# Altium schematic sheet X7A15T-Prog.SchDoc: X7A15T-Prog
size A4; Organization: Semi-ATE; SheetNumber: 7; SheetTotal: 7; Date: JUN 2020; ApprovedBy: Hören; CheckedBy: Mörz; Author: Hören; DrawnBy: Rudziński; Engineer: Hören
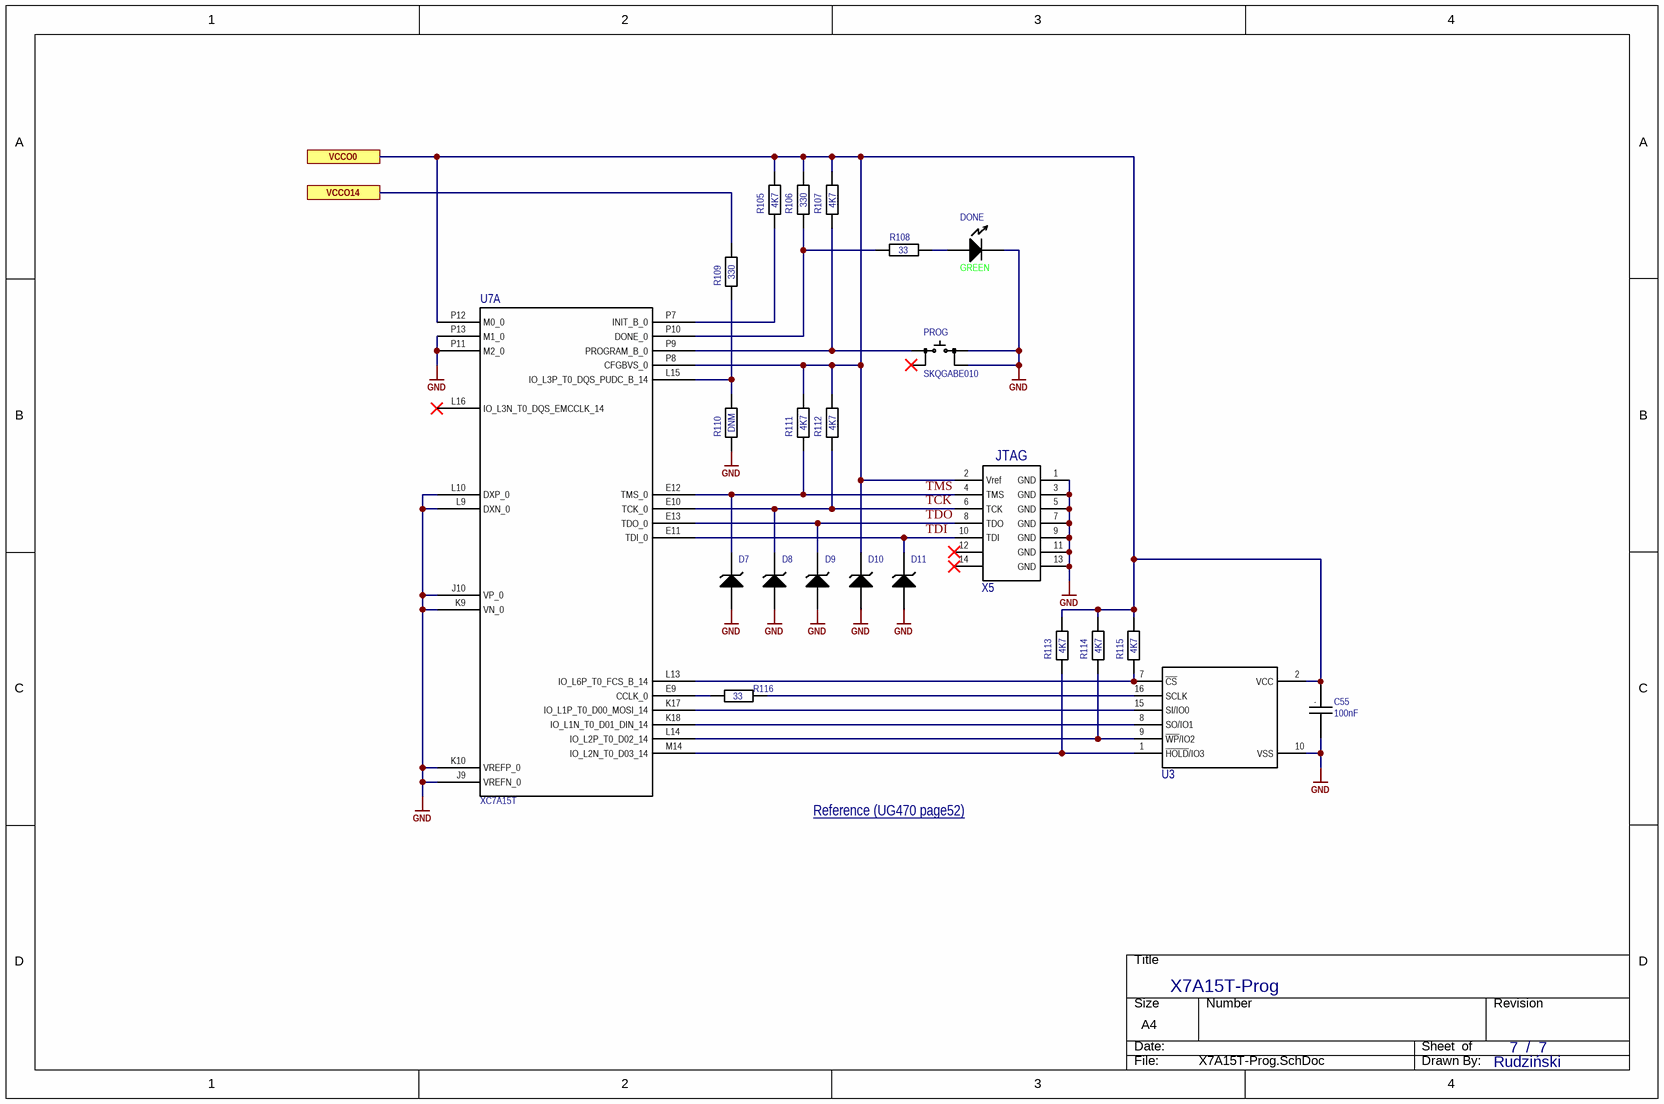
[diagram p0: X7A15T-Prog.SchDoc]

## Parts
C55  value 100nF  [C0402 Reflow]  (hidden comment: C)
D7  D  [SOD323]  (value not drawn)
D8  D  [SOD323]  (value not drawn)
D9  D  [SOD323]  (value not drawn)
D10  D  [SOD323]  (value not drawn)
D11  D  [SOD323]  (value not drawn)
DONE  Color: GREEN  [L0603G]  (hidden comment: D)
PROG  SKQGABE010  [SKQGABE010]
R105  value 4K7  [R0402 Reflow]  (hidden comment: R)
R106  value 330  [R0402 Reflow]  (hidden comment: R)
R107  value 4K7  [R0402 Reflow]  (hidden comment: R)
R108  value 33  [R0402 Reflow]  (hidden comment: R)
R109  value 330  [R0402 Reflow]  (hidden comment: R)
R110  value DNM  [R0402 Reflow]  (hidden comment: R)  (no BOM)
R111  value 4K7  [R0402 Reflow]  (hidden comment: R)
R112  value 4K7  [R0402 Reflow]  (hidden comment: R)
R113  value 4K7  [R0402 Reflow]  (hidden comment: R)
R114  value 4K7  [R0402 Reflow]  (hidden comment: R)
R115  value 4K7  [R0402 Reflow]  (hidden comment: R)
R116  value 33  [R0402 Reflow]  (hidden comment: R)
U3  U  [SOICW-16]  (value not drawn)
U7  NicName: XC7A15T  [XC7A15T-1CSG324C]  (hidden comment: U)  (part A of 8)
X5  NickName: JTAG  [LTMM-107-02-F-D]  (hidden comment: X)

## Ports
VCCO0, VCCO14

## Nets
GND: C55.2 D7.1(A) D8.1(A) D9.1(A) D10.1(A) D11.1(A) DONE.2(Cathode) PROG.3 PROG.4 R110.1 U3.10(VSS) U7.J9(VREFN_0) U7.J10(VP_0) U7.K9(VN_0) U7.K10(VREFP_0) U7.L9(DXN_0) U7.L10(DXP_0) U7.P11(M2_0) U7.P13(M1_0) X5.1(GND) X5.3(GND) X5.5(GND) X5.7(GND) X5.9(GND) X5.11(GND) X5.13(GND)
TCK: D8.2(C) R112.1 U7.E10(TCK_0) X5.6(TCK)
TDI: D11.2(C) U7.E11(TDI_0) X5.10(TDI)
TDO: D9.2(C) U7.E13(TDO_0) X5.8(TDO)
TMS: D7.2(C) R111.1 U7.E12(TMS_0) X5.4(TMS)
VCCO0: C55.1 D10.2(C) R105.2 R106.2 R107.2 R111.2 R112.2 R113.2 R114.2 R115.2 U3.2(VCC) U7.P8(CFGBVS_0) U7.P12(M0_0) X5.2(Vref) ; port VCCO0
VCCO14: R109.2 ; port VCCO14
NetDONE_1: DONE.1(Anode) R108.2
NetPROG_1: PROG.1 R107.1 U7.P9(PROGRAM_B_0)
NetR105_1: R105.1 U7.P7(INIT_B_0)
NetR106_1: R106.1 R108.1 U7.P10(DONE_0)
NetR109_1: R109.1 R110.2 U7.L15(IO_L3P_T0_DQS_PUDC_B_14)
NetR113_1: R113.1 U3.1(~{HOLD}/IO3) U7.M14(IO_L2N_T0_D03_14)
NetR114_1: R114.1 U3.9(~{WP}/IO2) U7.L14(IO_L2P_T0_D02_14)
NetR115_1: R115.1 U3.7(~{CS}) U7.L13(IO_L6P_T0_FCS_B_14)
NetR116_1: R116.1 U7.E9(CCLK_0)
NetR116_2: R116.2 U3.16(SCLK)
NetU3_8: U3.8(SO/IO1) U7.K18(IO_L1N_T0_D01_DIN_14)
NetU3_15: U3.15(SI/IO0) U7.K17(IO_L1P_T0_D00_MOSI_14)

Not connected (* = marked no-connect by the designer): PROG 2*; U7 L16(IO_L3N_T0_DQS_EMCCLK_14)*; X5 12* 14*

## Notes on the sheet
- Reference (UG470 page52) <https://www.xilinx.com/support/documentation/user_guides/ug470_7Series_Config.pdf>
- /
- designed by
- reviewed by
- last drawn by
- Project:
- Schematic:
- last printed
- DIN-A4 L
- sheets
- of
- File:
- (in symbol C) .

## Library data of the parts
C55 = C: CAP CER 0.1UF 25V X7R 0402; 04. Manufacturer: Yageo; 07. Manufacturer  Part Number: CC0402KRX7R8BB104; Tolerance: ±5%; Voltage Rating: 16V; 03. Unit Price: 0.09; 13. Created Date/Name: AUG2018/Hören; Type: X7R; ComponentLink1Description: Info; ComponentLink1URL: https://www.digikey.de/product-detail/en/kemet/C0402C104J4RACTU/399-7761-6-ND/3472292; 02. Distributor Part Number: 311-2077-6-ND; 09. Operating Temperature: -55°C ~ 125°C; 11. RoHS: YES; 01. Distributor: DigiKey; ComponentLink2Description: DataSheet; ComponentLink2URL: https://content.kemet.com/datasheets/KEM_C1002_X7R_SMD.pdf; Package: 0402
D7-D11 = UCLAMP3301D.TCT: TVS DIODE 3.3V 9.5V SOD323; 04. Manufacturer: Semtech Corporation; 03. Unit Price: 0.67; 01. Distributor: DigiKey; 02. Distributor Part Number: UCLAMP3301DCT-ND; 07. Manufacturer  Part Number: UCLAMP3301D.TCT; 11. RoHS: YES; ComponentLink1Description: Info; ComponentLink1URL: https://www.digikey.de/product-detail/en/nexperia-usa-inc/PMEG4050EP115/1727-5842-6-ND/2697559; ComponentLink2Description: DataSheet; ComponentLink2URL: https://assets.nexperia.com/documents/data-sheet/PMEG4050EP.pdf
DONE = LED: LED GREEN DIFFUSED 0603 SMD; 04. Manufacturer: OSRAM Opto Semiconductors Inc.; 07. Manufacturer  Part Number: LG L29K-G2J1-24-Z; Vf: 1.7V; If: 2mA; Wave Length: 570nm; Viewing Angle: 160°; 03. Unit Price: 0.4; 13. Created Date/Name: AUG2018/Hören; ComponentLink1Description: Info; ComponentLink1URL: https://www.digikey.de/products/en?keywords=475-2709-6-ND; ComponentLink2Description: DataSheet; ComponentLink2URL: https://www.digikey.de/products/en?keywords=475-2709-6-ND; 02. Distributor Part Number: 475-2709-6-ND; 11. RoHS: YES; 01. Distributor: DigiKey
PROG = PUSH_BTN: Tactile Switches 5.2x5.2x1.5mm 160gf; 04. Manufacturer: Alps; 03. Unit Price: 0.497; ComponentLink1URL: *; ComponentLink1Description: Info; 02. Distributor Part Number: 688-SKQGAB; 07. Manufacturer  Part Number: SKQGABE010; 11. RoHS: YES; 01. Distributor: Mouser; ComponentLink2Description: DataSheet; Value: SKQGABE010
R105 R107 R111-R115 = R: RES SMD 4.7K OHM 1% 1/16W 0402; 04. Manufacturer: Yageo; 07. Manufacturer  Part Number: RC0402FR-074K7L; 03. Unit Price: 0.09; 13. Created Date/Name: AUG2018/Hören; Power Rating: 63mW; Tolerance: ±1%; ComponentLink1URL: https://www.digikey.de/products/en?keywords=311-4.7KLRDKR-ND; ComponentLink1Description: Info; 02. Distributor Part Number: 311-4.7KLRDKR-ND; 09. Operating Temperature: -55°C ~ 155°C; 11. RoHS: YES; 01. Distributor: DigiKey; ComponentLink2Description: DataSheet; Type: Thick Film; Package: 0402
R106 R109 R110 = R: RES SMD 330 OHM 1% 1/16W 0402; 04. Manufacturer: Yageo; 07. Manufacturer  Part Number: RC0402FR-07330RL; 03. Unit Price: 0.09; 13. Created Date/Name: AUG2018/Hören; Power Rating: 63mW; Tolerance: ±1%; ComponentLink1URL: https://www.digikey.de/products/en?keywords=311-330LRDKR-ND; ComponentLink1Description: Info; 02. Distributor Part Number: 311-330LRDKR-ND; 09. Operating Temperature: -55°C ~ 155°C; 11. RoHS: YES; 01. Distributor: DigiKey; ComponentLink2Description: DataSheet; Type: Thick Film; Package: 0402
R108 R116 = R_19: RES SMD 33 OHM 1% 1/16W 0402; 04. Manufacturer: Yageo; 07. Manufacturer  Part Number: RC0402FR-0733RL; 03. Unit Price: 0.09; 13. Created Date/Name: AUG2018/Hören; Power Rating: 63mW; Tolerance: ±1%; ComponentLink1URL: https://www.digikey.de/products/en?keywords=311-33.0LRDKR-ND; ComponentLink1Description: Info; 02. Distributor Part Number: 311-33.0LRDKR-ND; 09. Operating Temperature: -55°C ~ 155°C; 11. RoHS: YES; 01. Distributor: DigiKey; ComponentLink2Description: DataSheet; Type: Thick Film; Package: 0402
U3 = S25FL128SAGMFI000: IC FLASH 128M SPI 133MHZ 16SOIC; 04. Manufacturer: Cypress Semiconductor Corp; 03. Unit Price: 2.77; 01. Distributor: Digikey; 02. Distributor Part Number: 1274-1000-ND; 07. Manufacturer  Part Number: IC FLASH 128M SPI 133MHZ 16SOIC; ComponentLink2Description: DataSheet; NickName: S25FL128SAGMFI000
U7 = XC7A15T-CS324: XC7A15T-1CSG324C; MFR: XILINX; POPULATED: yes; 03. Unit Price: 20.65; MFR-PN: XC7A15T-CS324; 04. Manufacturer: XILINX; 07. Manufacturer  Part Number: XC7A15T-1CSG324C; 01. Distributor: Avnet; 02. Distributor Part Number: XC7A15T-1CSG324C; 09. Operating Temperature: 0°C ~ 85°C (TJ); 11. RoHS: YES; ComponentLink4Description: Info; ComponentLink4URL: https://www.digikey.de/products/en?keywords=XC7A15T-1CSG324C; ComponentLink5Description: DataSheet; ComponentLink5URL: https://www.xilinx.com/support/documentation/data_sheets/ds181_Artix_7_Data_Sheet.pdf; ComponentLink6Description: NXP; ComponentLink6URL: https://www.nxp.com/part/MK20DN512VMD10
X5 = LTMM-107-02-F-D: CONN HEADER VERT 14POS 2MM; 04. Manufacturer: Samtec Inc.; 03. Unit Price: 2.38; 13. Created Date/Name: ??? / Hören; System: Connector; 01. Distributor: DigiKey; 02. Distributor Part Number: LTMM-107-02-F-D-ND; 07. Manufacturer  Part Number: LTMM-107-02-F-D; 11. RoHS: YES; ComponentLink1Description: Info; ComponentLink1URL: https://www.digikey.de/product-detail/en/samtec-inc/LTMM-107-02-F-D/LTMM-107-02-F-D-ND/8723899; ComponentLink2Description: DataSheet; ComponentLink2URL: https://www.samtec.com/products/ltmm